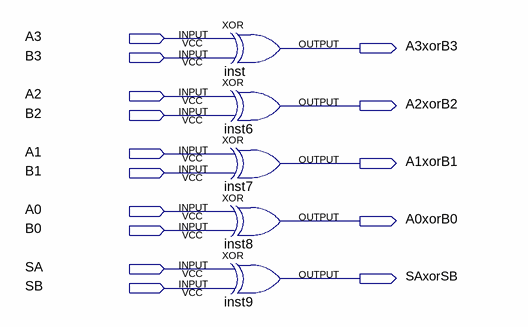
[diagram p0: schematic sheet]
// Quartus schematic AxorB.bdf as structural Verilog: 5 symbols, 15 pins
module AxorB (
  input  A3,
  input  B3,
  input  A2,
  input  B2,
  input  A1,
  input  B1,
  input  A0,
  input  B0,
  input  SA,
  input  SB,
  output A3xorB3,
  output A2xorB2,
  output A1xorB1,
  output A0xorB0,
  output SAxorSB
);

  xor inst (A3xorB3, A3, B3);
  xor inst6 (A2xorB2, A2, B2);
  xor inst7 (A1xorB1, A1, B1);
  xor inst8 (A0xorB0, A0, B0);
  xor inst9 (SAxorSB, SA, SB);
endmodule
